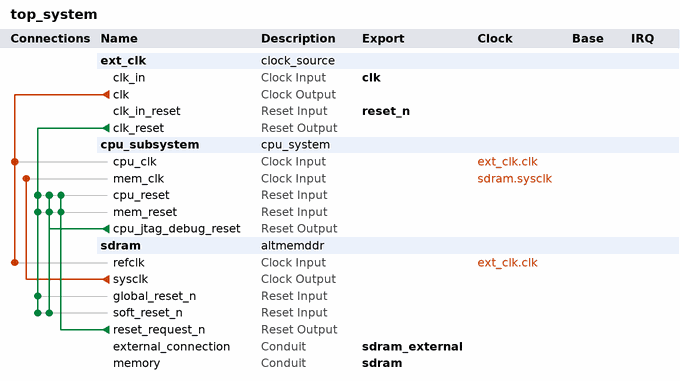
[diagram p0: system contents]
# Platform Designer (Qsys) system top_system
# Parameters at their usual value, and those the tool derives, are not listed.
package require -exact qsys 11.0
create_system top_system
set_project_property DEVICE_FAMILY CYCLONEIII

add_instance ext_clk clock_source 11.0
set_instance_parameter_value ext_clk clockFrequency 50000000

add_instance cpu_subsystem cpu_system 1.0

add_instance sdram altmemddr 11.0
set_instance_parameter_value sdram pipeline_commands false
set_instance_parameter_value sdram debug_en false
set_instance_parameter_value sdram export_debug_port false
set_instance_parameter_value sdram use_generated_memory_model true
set_instance_parameter_value sdram dedicated_memory_clk_phase_label {Dedicated memory clock phase:}
set_instance_parameter_value sdram mem_if_clk_mhz 150.0
set_instance_parameter_value sdram quartus_project_exists false
set_instance_parameter_value sdram local_if_drate Full
set_instance_parameter_value sdram enable_v72_rsu false
set_instance_parameter_value sdram local_if_clk_mhz_label 150.0
set_instance_parameter_value sdram new_variant false
set_instance_parameter_value sdram mem_if_memtype {DDR SDRAM}
set_instance_parameter_value sdram pll_ref_clk_mhz 50.0
set_instance_parameter_value sdram mem_if_clk_ps_label {(6667 ps)}
set_instance_parameter_value sdram family {Cyclone III}
set_instance_parameter_value sdram project_family {Cyclone III}
set_instance_parameter_value sdram speed_grade 6
set_instance_parameter_value sdram dedicated_memory_clk_phase 0
set_instance_parameter_value sdram pll_ref_clk_ps_label {(20000 ps)}
set_instance_parameter_value sdram avalon_burst_length 1
set_instance_parameter_value sdram mem_if_clk_pair_count 1
set_instance_parameter_value sdram mem_if_cs_per_dimm 1
set_instance_parameter_value sdram pre_latency_label {Fix read latency at:}
set_instance_parameter_value sdram dedicated_memory_clk_en false
set_instance_parameter_value sdram mirror_addressing 0
set_instance_parameter_value sdram mem_if_bankaddr_width 2
set_instance_parameter_value sdram register_control_word_9 0000
set_instance_parameter_value sdram mem_if_rowaddr_width 13
set_instance_parameter_value sdram mem_dyn_deskew_en false
set_instance_parameter_value sdram post_latency_label {cycles (0 cycles=minimum latency, non-deterministic)}
set_instance_parameter_value sdram mem_if_dm_pins_en Yes
set_instance_parameter_value sdram local_if_dwidth_label 32
set_instance_parameter_value sdram register_control_word_7 0000
set_instance_parameter_value sdram register_control_word_8 0000
set_instance_parameter_value sdram mem_if_preset {PSC A2S56D40CTP-G5}
set_instance_parameter_value sdram mem_if_pchaddr_bit 10
set_instance_parameter_value sdram WIDTH_RATIO 4
set_instance_parameter_value sdram vendor Other
set_instance_parameter_value sdram register_control_word_3 0000
set_instance_parameter_value sdram register_control_word_4 0000
set_instance_parameter_value sdram chip_or_dimm {Discrete Device}
set_instance_parameter_value sdram register_control_word_5 0000
set_instance_parameter_value sdram register_control_word_6 0000
set_instance_parameter_value sdram mem_fmax 200.0
set_instance_parameter_value sdram register_control_word_0 0000
set_instance_parameter_value sdram register_control_word_size 4
set_instance_parameter_value sdram register_control_word_1 0000
set_instance_parameter_value sdram register_control_word_2 0000
set_instance_parameter_value sdram register_control_word_11 0000
set_instance_parameter_value sdram register_control_word_10 0000
set_instance_parameter_value sdram mem_if_cs_width 1
set_instance_parameter_value sdram mem_if_preset_rlat 0
set_instance_parameter_value sdram mem_if_cs_per_rank 1
set_instance_parameter_value sdram fast_simulation_en FAST
set_instance_parameter_value sdram register_control_word_15 0000
set_instance_parameter_value sdram register_control_word_14 0000
set_instance_parameter_value sdram mem_if_dwidth 16
set_instance_parameter_value sdram mem_if_dq_per_dqs 8
set_instance_parameter_value sdram mem_if_coladdr_width 9
set_instance_parameter_value sdram register_control_word_13 0000
set_instance_parameter_value sdram register_control_word_12 0000
set_instance_parameter_value sdram mem_tiha_ps 600
set_instance_parameter_value sdram mem_tdsh_ck 0.2
set_instance_parameter_value sdram mem_if_trfc_ns 70.0
set_instance_parameter_value sdram mem_tqh_ck 0.36
set_instance_parameter_value sdram mem_tisa_ps 600
set_instance_parameter_value sdram mem_tdss_ck 0.2
set_instance_parameter_value sdram mem_trtp_ns 0.0
set_instance_parameter_value sdram mem_if_tinit_us 200.0
set_instance_parameter_value sdram mem_if_trcd_ns 15.0
set_instance_parameter_value sdram mem_if_twtr_ck 2
set_instance_parameter_value sdram mem_trrd_ns 10.0
set_instance_parameter_value sdram mem_tdqss_ck 0.28
set_instance_parameter_value sdram mem_tqhs_ps 500
set_instance_parameter_value sdram mem_tdsa_ps 400
set_instance_parameter_value sdram mem_tac_ps 700
set_instance_parameter_value sdram mem_tdha_ps 400
set_instance_parameter_value sdram mem_if_tras_ns 40.0
set_instance_parameter_value sdram mem_if_twr_ns 15.0
set_instance_parameter_value sdram mem_tdqsck_ps 550
set_instance_parameter_value sdram mem_if_trp_ns 15.0
set_instance_parameter_value sdram mem_tdqsq_ps 400
set_instance_parameter_value sdram mem_if_tmrd_ns 10.0
set_instance_parameter_value sdram mem_tfaw_ns 0.0
set_instance_parameter_value sdram mem_if_trefi_us 7.0
set_instance_parameter_value sdram mem_tcl_40_fmax 533.0
set_instance_parameter_value sdram mem_odt Disabled
set_instance_parameter_value sdram mp_WLH_percent 0.6
set_instance_parameter_value sdram mem_drv_str Normal
set_instance_parameter_value sdram mp_DH_percent 0.5
set_instance_parameter_value sdram input_period 0
set_instance_parameter_value sdram mp_QH_percent 0.5
set_instance_parameter_value sdram mp_QHS_percent 0.5
set_instance_parameter_value sdram mem_tcl_30_fmax 200.0
set_instance_parameter_value sdram ac_clk_select 90
set_instance_parameter_value sdram mp_DQSQ_percent 0.65
set_instance_parameter_value sdram mp_DS_percent 0.6
set_instance_parameter_value sdram pll_reconfig_ports_en false
set_instance_parameter_value sdram mem_btype Sequential
set_instance_parameter_value sdram mp_IS_percent 0.7
set_instance_parameter_value sdram mem_tcl 3.0
set_instance_parameter_value sdram mp_DQSS_percent 0.5
set_instance_parameter_value sdram export_bank_info false
set_instance_parameter_value sdram mp_DSS_percent 0.6
set_instance_parameter_value sdram mem_dll_en Yes
set_instance_parameter_value sdram ac_phase 90
set_instance_parameter_value sdram mem_if_oct_en false
set_instance_parameter_value sdram mem_tcl_60_fmax 533.0
set_instance_parameter_value sdram mp_DSH_percent 0.6
set_instance_parameter_value sdram mem_if_dqsn_en false
set_instance_parameter_value sdram enable_mp_calibration true
set_instance_parameter_value sdram mp_IH_percent 0.6
set_instance_parameter_value sdram mem_tcl_15_fmax 533.0
set_instance_parameter_value sdram dll_external false
set_instance_parameter_value sdram mem_bl 4
set_instance_parameter_value sdram mp_WLS_percent 0.7
set_instance_parameter_value sdram mem_tcl_50_fmax 533.0
set_instance_parameter_value sdram mp_DQSCK_percent 0.5
set_instance_parameter_value sdram mem_tcl_25_fmax 200.0
set_instance_parameter_value sdram mem_tcl_20_fmax 133.333
set_instance_parameter_value sdram cfg_reorder_data false
set_instance_parameter_value sdram ctl_ecc_en false
set_instance_parameter_value sdram ctl_hrb_en false
set_instance_parameter_value sdram ref_clk_source ext_clk
set_instance_parameter_value sdram cfg_data_reordering_type INTER_ROW
set_instance_parameter_value sdram ctl_powerdn_en false
set_instance_parameter_value sdram multicast_wr_en false
set_instance_parameter_value sdram auto_powerdn_cycles 0
set_instance_parameter_value sdram ctl_self_refresh_en false
set_instance_parameter_value sdram cfg_starve_limit 4
set_instance_parameter_value sdram ctl_latency 5
set_instance_parameter_value sdram tool_context SOPC_BUILDER
set_instance_parameter_value sdram mem_addr_mapping CHIP_ROW_BANK_COL
set_instance_parameter_value sdram burst_merge_en true
set_instance_parameter_value sdram user_refresh_en false
set_instance_parameter_value sdram qsys_mode true
set_instance_parameter_value sdram clk_source_sharing_en false
set_instance_parameter_value sdram ctl_lookahead_depth 4
set_instance_parameter_value sdram ctl_autopch_en false
set_instance_parameter_value sdram ctl_dynamic_bank_allocation false
set_instance_parameter_value sdram ctl_dynamic_bank_num 4
set_instance_parameter_value sdram local_if_type_avalon true
set_instance_parameter_value sdram csr_en false
set_instance_parameter_value sdram ctl_auto_correct_en false
set_instance_parameter_value sdram auto_powerdn_en false
set_instance_parameter_value sdram phy_if_type_afi true
set_instance_parameter_value sdram controller_type ngv110_ctl
set_instance_parameter_value sdram max_local_size 2
set_instance_parameter_value sdram mem_srtr Normal
set_instance_parameter_value sdram mem_mpr_loc {Predefined Pattern}
set_instance_parameter_value sdram dss_tinit_rst_us 200.0
set_instance_parameter_value sdram mem_tcl_90_fmax 400.0
set_instance_parameter_value sdram mem_rtt_wr {Dynamic ODT off}
set_instance_parameter_value sdram mem_tcl_100_fmax 400.0
set_instance_parameter_value sdram mem_pasr {Full Array}
set_instance_parameter_value sdram mem_asrm {Manual SR Reference (SRT)}
set_instance_parameter_value sdram mem_mpr_oper {Predefined Pattern}
set_instance_parameter_value sdram mem_tcl_80_fmax 400.0
set_instance_parameter_value sdram mem_drv_impedance RZQ/7
set_instance_parameter_value sdram mem_rtt_nom {ODT Disabled}
set_instance_parameter_value sdram mem_tcl_70_fmax 400.0
set_instance_parameter_value sdram mem_wtcl 5.0
set_instance_parameter_value sdram mem_dll_pch {Fast Exit}
set_instance_parameter_value sdram mem_atcl Disabled
set_instance_parameter_value sdram board_settings_valid true
set_instance_parameter_value sdram t_IH 0.6
set_instance_parameter_value sdram board_intra_DQS_group_skew 0.02
set_instance_parameter_value sdram isi_DQS 0.0
set_instance_parameter_value sdram addr_cmd_slew_rate 1.0
set_instance_parameter_value sdram board_tpd_inter_DIMM 0.05
set_instance_parameter_value sdram board_addresscmd_CK_skew 0.0
set_instance_parameter_value sdram t_DS_calculated 0.400
set_instance_parameter_value sdram isi_addresscmd_hold 0.0
set_instance_parameter_value sdram t_IS 0.6
set_instance_parameter_value sdram restore_default_toggle false
set_instance_parameter_value sdram dqs_dqsn_slew_rate 2.0
set_instance_parameter_value sdram dq_slew_rate 1.0
set_instance_parameter_value sdram board_inter_DQS_group_skew 0.02
set_instance_parameter_value sdram isi_addresscmd_setup 0.0
set_instance_parameter_value sdram board_minCK_DQS_skew -0.01
set_instance_parameter_value sdram t_IS_calculated 0.600
set_instance_parameter_value sdram num_slots_or_devices 1
set_instance_parameter_value sdram board_maxCK_DQS_skew 0.01
set_instance_parameter_value sdram board_skew_ps 20
set_instance_parameter_value sdram t_DH 0.4
set_instance_parameter_value sdram ck_ckn_slew_rate 2.0
set_instance_parameter_value sdram isi_DQ 0.0
set_instance_parameter_value sdram t_IH_calculated 0.600
set_instance_parameter_value sdram t_DH_calculated 0.400
set_instance_parameter_value sdram t_DS 0.4

# connections
add_connection ext_clk.clk cpu_subsystem.cpu_clk clock
add_connection ext_clk.clk sdram.refclk clock
add_connection sdram.sysclk cpu_subsystem.mem_clk clock
add_connection cpu_subsystem.cpu_jtag_debug_reset cpu_subsystem.cpu_reset reset
add_connection cpu_subsystem.cpu_jtag_debug_reset cpu_subsystem.mem_reset reset
add_connection cpu_subsystem.cpu_jtag_debug_reset sdram.soft_reset_n reset
add_connection ext_clk.clk_reset cpu_subsystem.cpu_reset reset
add_connection ext_clk.clk_reset cpu_subsystem.mem_reset reset
add_connection ext_clk.clk_reset sdram.global_reset_n reset
add_connection ext_clk.clk_reset sdram.soft_reset_n reset
add_connection sdram.reset_request_n cpu_subsystem.cpu_reset reset
add_connection sdram.reset_request_n cpu_subsystem.mem_reset reset

# exported interfaces
add_interface clk clock sink
set_interface_property clk EXPORT_OF ext_clk.clk_in
add_interface reset_n reset sink
set_interface_property reset_n EXPORT_OF ext_clk.clk_in_reset
add_interface sdram_external conduit end
set_interface_property sdram_external EXPORT_OF sdram.external_connection
add_interface sdram conduit end
set_interface_property sdram EXPORT_OF sdram.memory

save_system top_system.qsys
